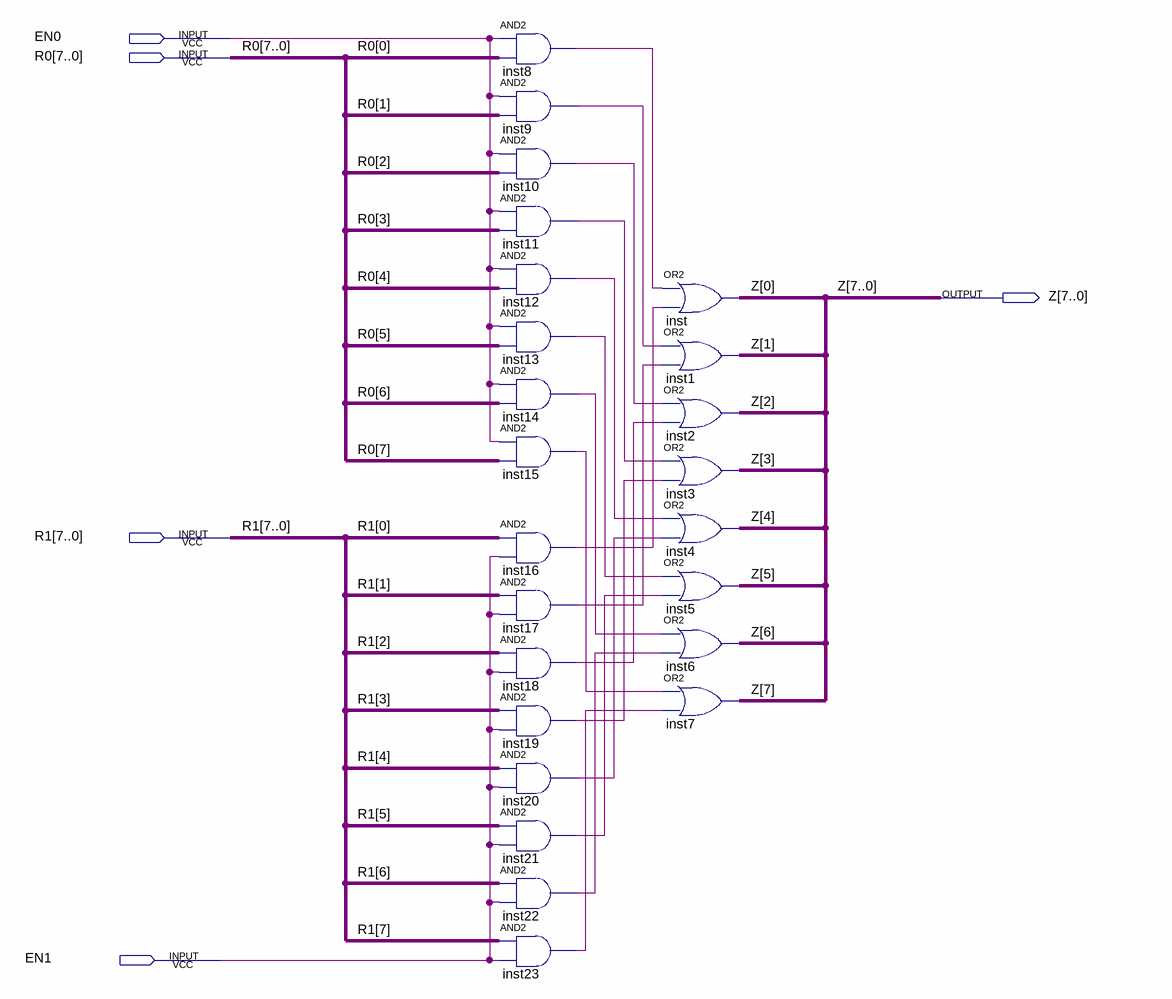
[diagram p0: schematic sheet]
// Quartus schematic choose_2.bdf as structural Verilog: 24 symbols, 5 pins
module choose_2 (
  input  EN0,
  input  [7:0] R0,
  input  [7:0] R1,
  input  EN1,
  output [7:0] Z
);

  wire inst8_out, inst9_out, inst10_out, inst11_out, inst12_out, inst13_out, inst14_out, inst15_out,
       inst16_out, inst17_out, inst18_out, inst19_out, inst20_out, inst21_out, inst22_out, inst23_out;

  and inst8 (inst8_out, EN0, R0[0]);
  and inst9 (inst9_out, EN0, R0[1]);
  and inst10 (inst10_out, EN0, R0[2]);
  and inst11 (inst11_out, EN0, R0[3]);
  and inst12 (inst12_out, EN0, R0[4]);
  and inst13 (inst13_out, EN0, R0[5]);
  and inst14 (inst14_out, EN0, R0[6]);
  and inst15 (inst15_out, EN0, R0[7]);
  and inst16 (inst16_out, R1[0], EN1);
  and inst17 (inst17_out, R1[1], EN1);
  and inst18 (inst18_out, R1[2], EN1);
  and inst19 (inst19_out, R1[3], EN1);
  and inst20 (inst20_out, R1[4], EN1);
  and inst21 (inst21_out, R1[5], EN1);
  and inst22 (inst22_out, R1[6], EN1);
  and inst23 (inst23_out, R1[7], EN1);
  or inst (Z[0], inst8_out, inst16_out);
  or inst1 (Z[1], inst9_out, inst17_out);
  or inst2 (Z[2], inst10_out, inst18_out);
  or inst3 (Z[3], inst11_out, inst19_out);
  or inst4 (Z[4], inst12_out, inst20_out);
  or inst5 (Z[5], inst13_out, inst21_out);
  or inst6 (Z[6], inst14_out, inst22_out);
  or inst7 (Z[7], inst15_out, inst23_out);
endmodule
